# Altium schematic sheet 存储物柜V1.0.SchDoc
size A1
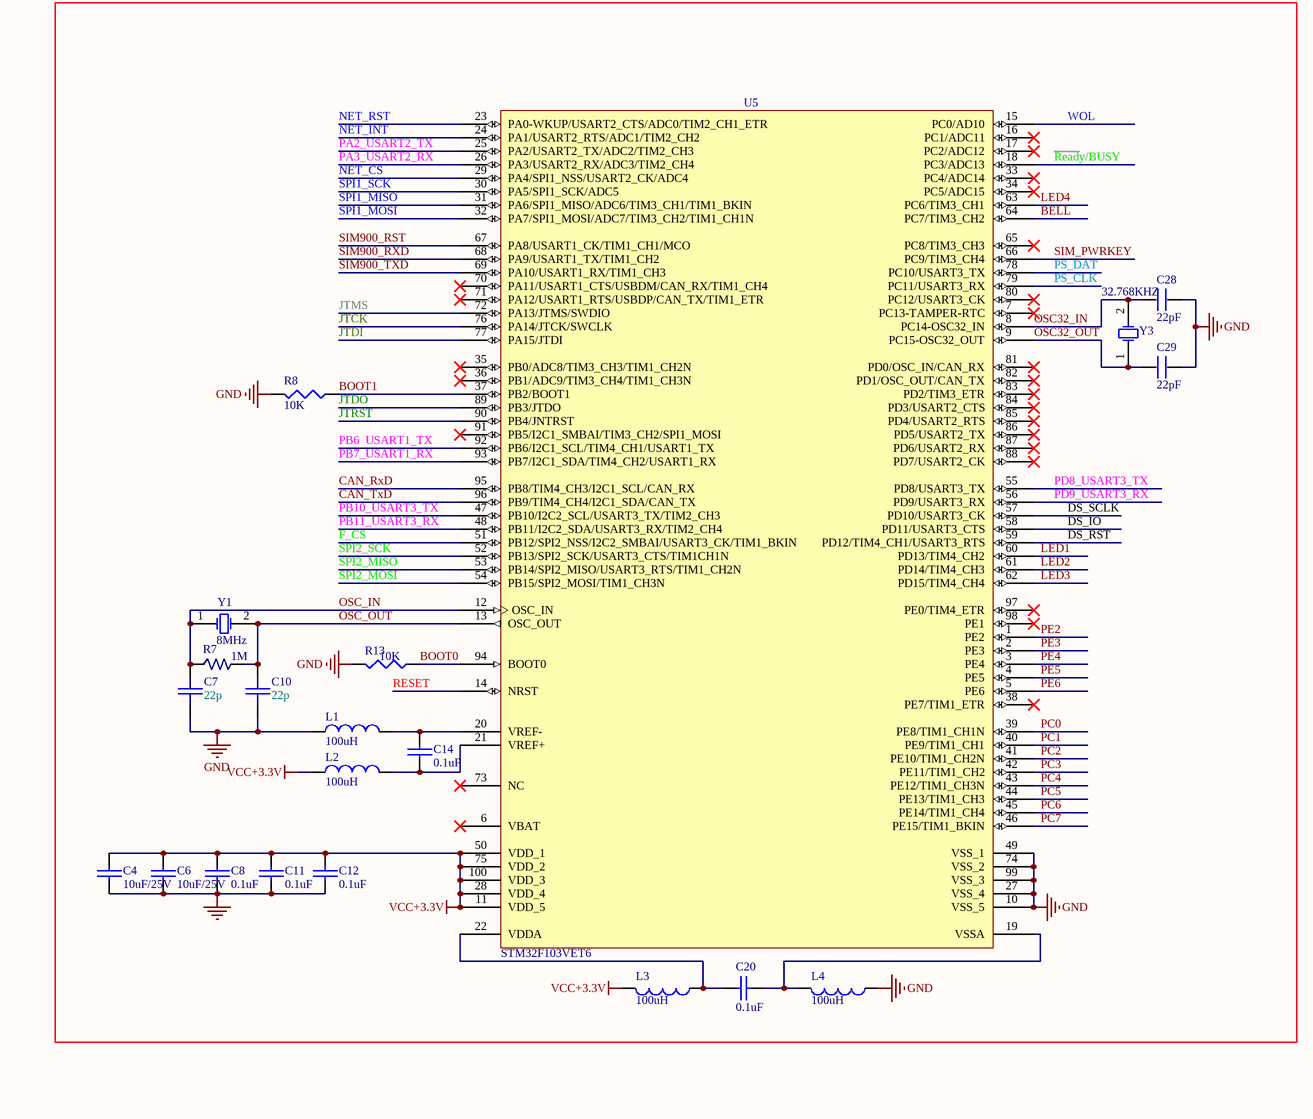
[diagram p0: 存储物柜V1.0.SchDoc, top left]
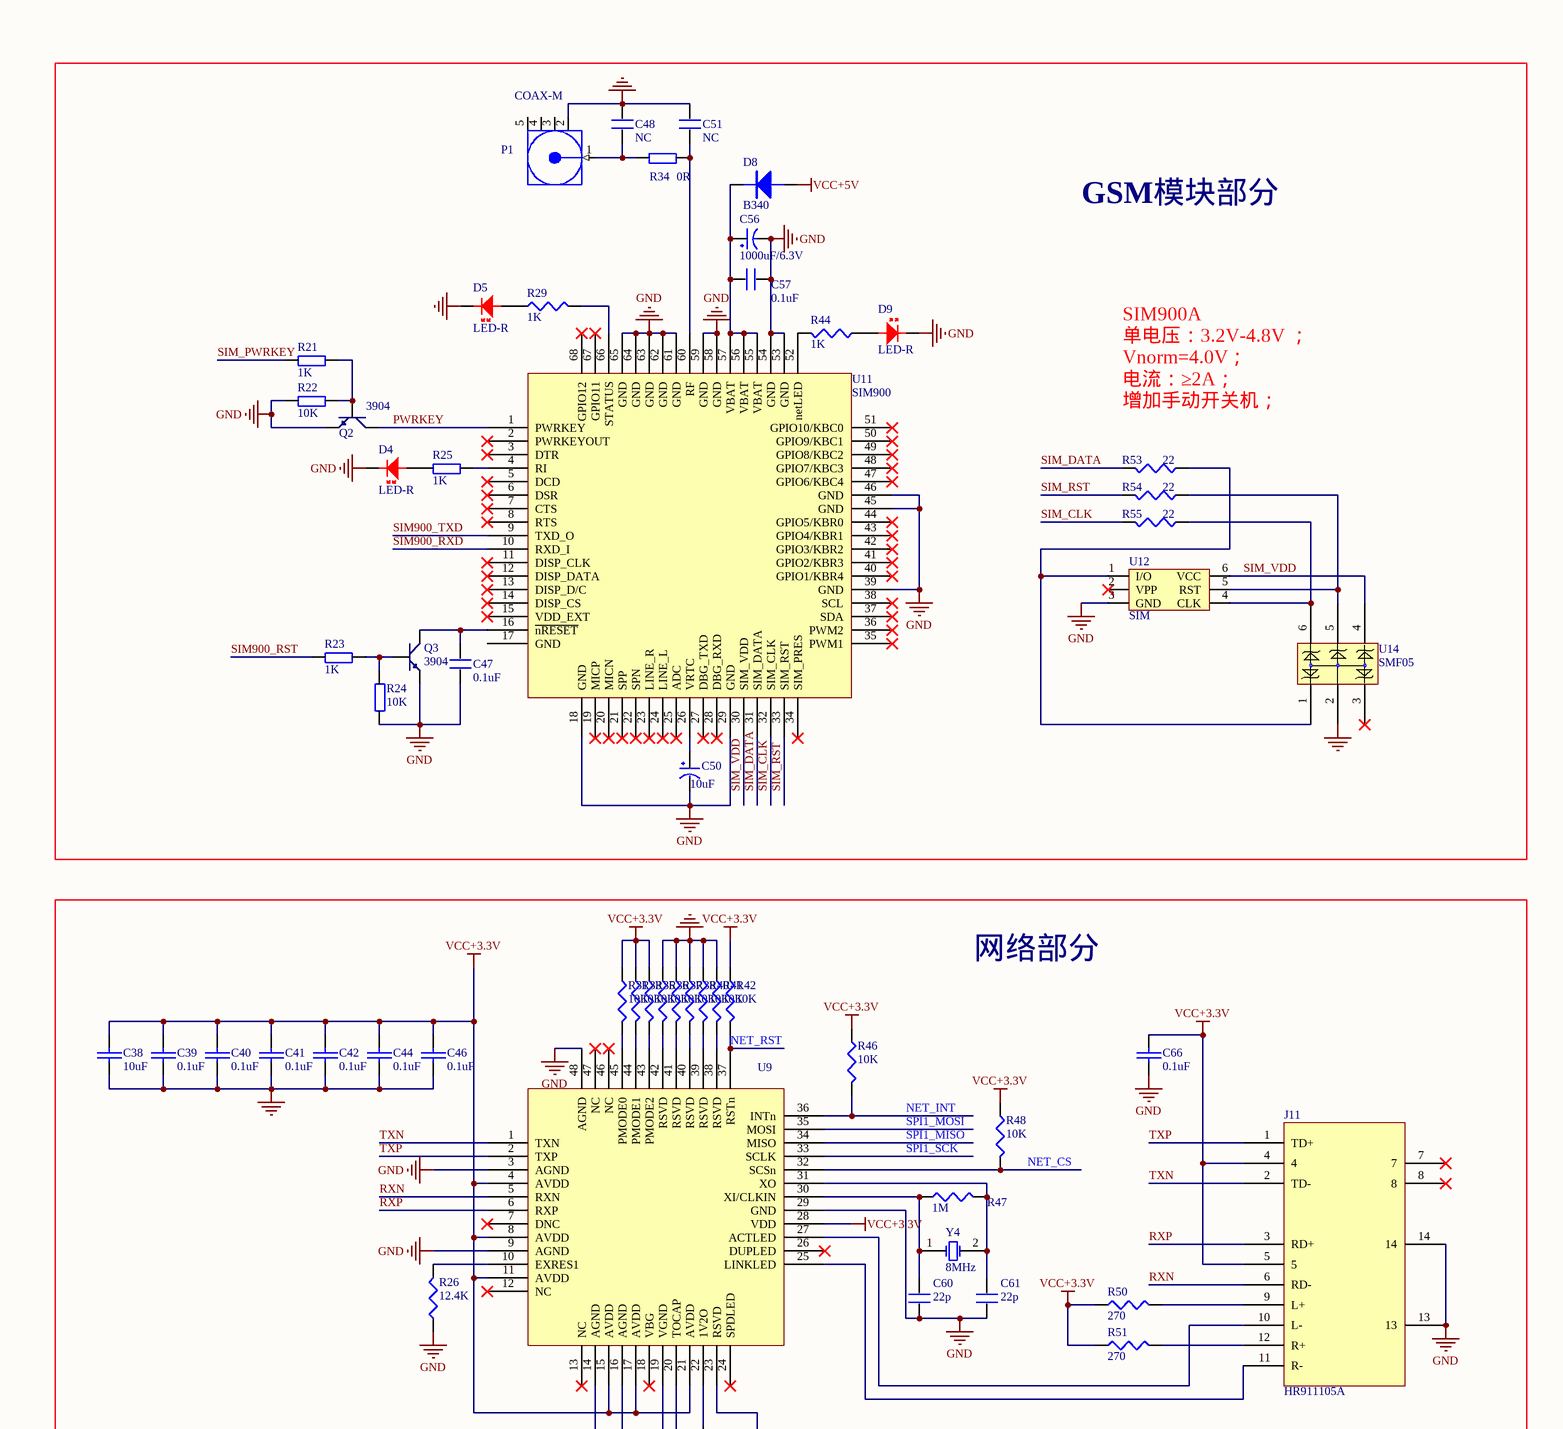
[diagram p1: 存储物柜V1.0.SchDoc, top right]
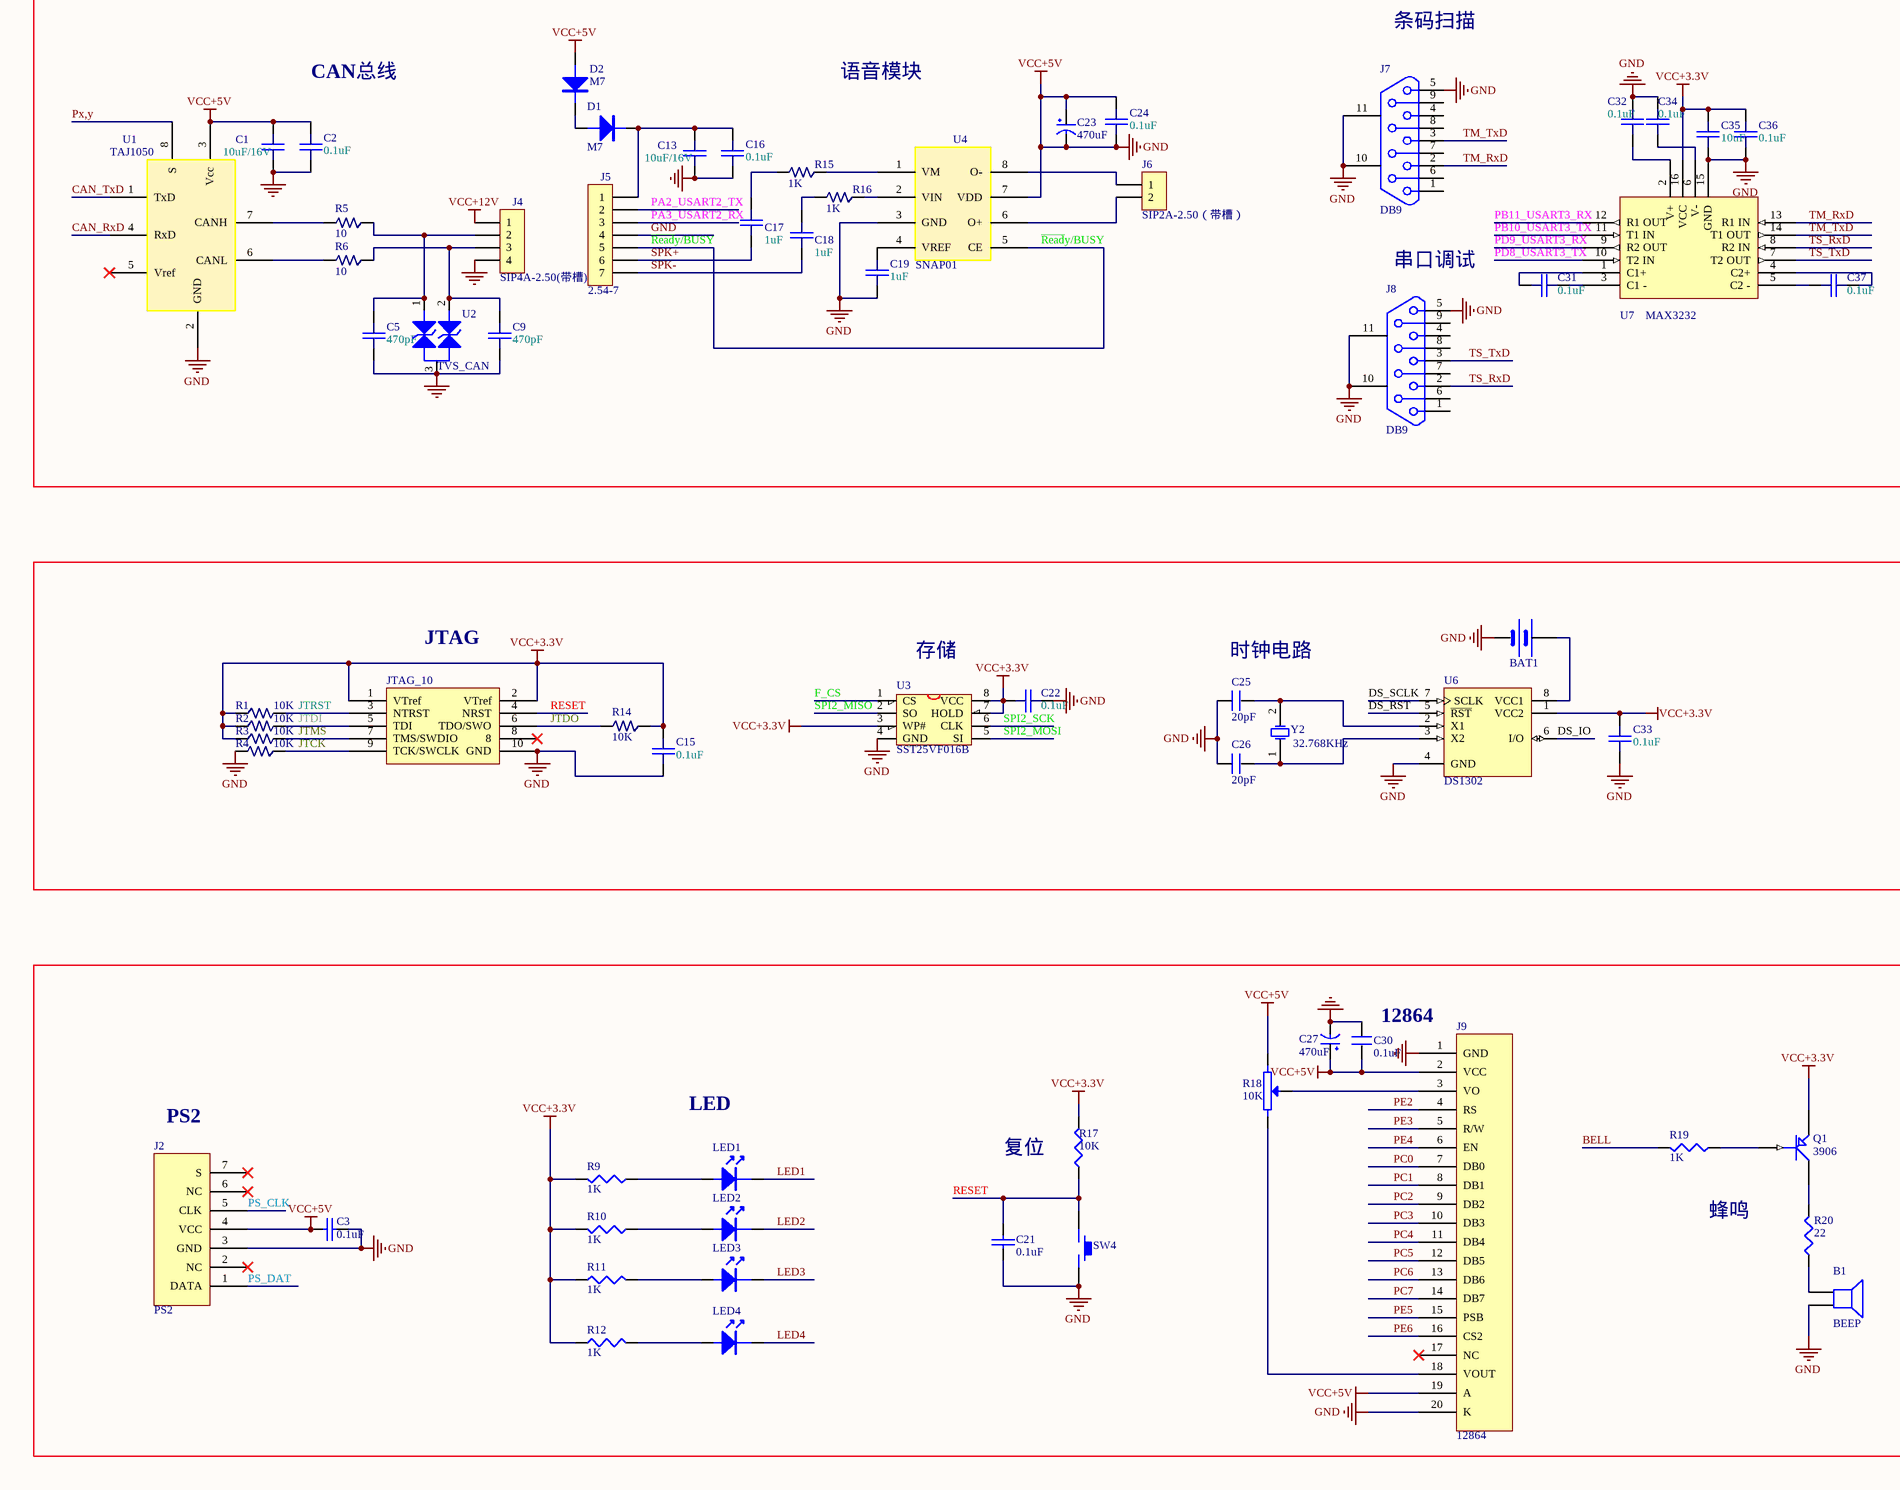
[diagram p2: 存储物柜V1.0.SchDoc, bottom left]
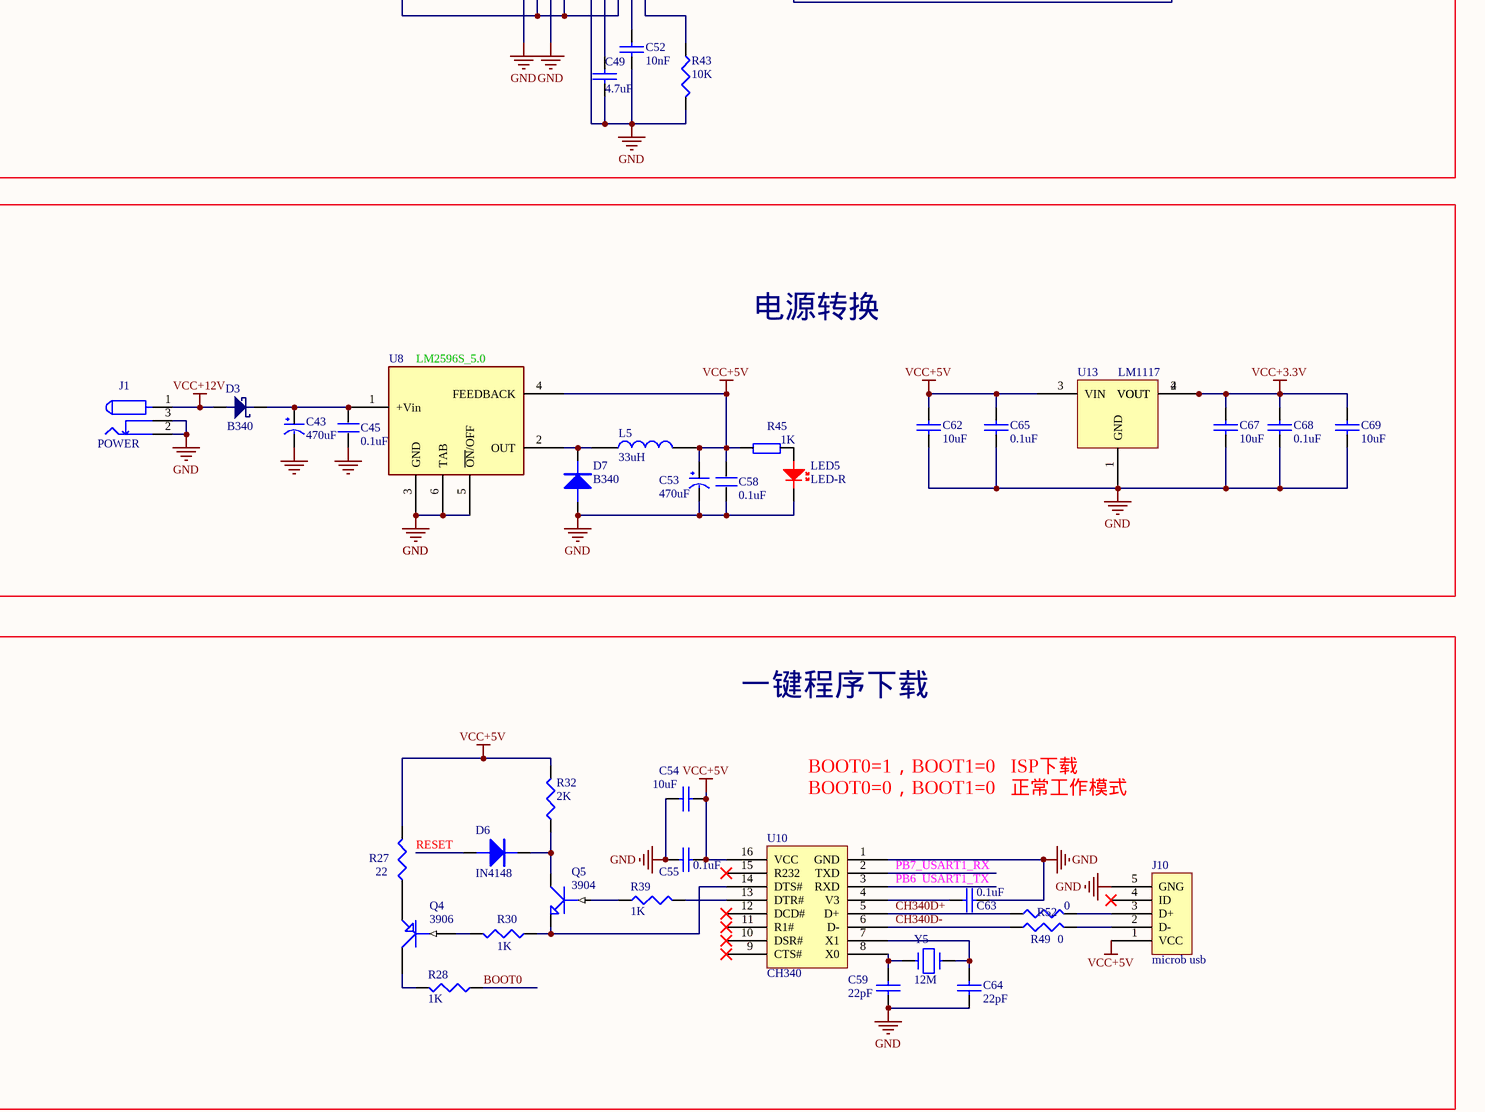
[diagram p3: 存储物柜V1.0.SchDoc, bottom right]

## Parts
B1  BEEP  [BEEP-12]
BAT1  BATT  [BATM]  (value not drawn)
C1  10uF/16V  [0805]
C2  0.1uF  [0603]
C3  0.1uF  [0603]
C4  10uF/25V  [0805]
C5  470pF  [0603]
C6  10uF/25V  [0805]
C7  22p  [0603]
C8  0.1uF  [0603]
C9  470pF  [0603]
C10  22p  [0603]
C11  0.1uF  [0603]
C12  0.1uF  [0603]
C13  10uF/16V  [0805]
C14  0.1uF  [0603]
C15  0.1uF  [0603]
C16  0.1uF  [0603]
C17  1uF  [0603]
C18  1uF  [0603]
C19  1uF  [0603]
C20  0.1uF  [0603]
C21  0.1uF  [0603]
C22  0.1uF  [0603]
C23  470uF  [RB5.0-8]
C24  0.1uF  [0603]
C25  20pF  [0603]
C26  20pF  [0603]
C27  470uF  [RB5.0-8]
C28  22pF  [0603]
C29  22pF  [0603]
C30  0.1uF  [0603]
C31  0.1uF  [0603]
C32  0.1uF  [0603]
C33  0.1uF  [0603]
C34  0.1uF  [0603]
C35  10uF  [0805]
C36  0.1uF  [0603]
C37  0.1uF  [0603]
C38  10uF  [0805]
C39  0.1uF  [0603]
C40  0.1uF  [0603]
C41  0.1uF  [0603]
C42  0.1uF  [0603]
C43  470uF  [RB5.0-8]
C44  0.1uF  [0603]
C45  0.1uF  [0603]
C46  0.1uF  [0603]
C47  0.1uF  [0603]
C48  NC  [0603]
C49  4.7uF  [0805]
C50  10uF  [0805]
C51  NC  [0603]
C52  10nF  [0603]
C53  470uF  [RB5.0-8]
C54  10uF  [0805]
C55  0.1uF  [0603]
C56  1000uF/6.3V  [7343]
C57  0.1uF  [0603]
C58  0.1uF  [0603]
C59  22pF  [0603]
C60  22p  [0603]
C61  22p  [0603]
C62  10uF  [0805]
C63  0.1uF  [0603]
C64  22pF  [0603]
C65  0.1uF  [0603]
C66  0.1uF  [0603]
C67  10uF  [0805]
C68  0.1uF  [0603]
C69  10uF  [0805]
D1  M7  [SMB]
D2  M7  [SMB]
D3  B340  [SMB]
D4  LED-R  [LED-0805]
D5  LED-R  [LED-0805]
D6  IN4148  [SOD-23]
D7  B340  [SMB]
D8  B340  [SMB]
D9  LED-R  [LED-0805]
J1  POWER  [DC10B]
J2  PS2  [PS2-6PIN]
J3  JTAG_10  [JTAG_10]
J4  SIP4A-2.50(带槽)  [5.08_4P]
J5  2.54-7  [SYN6288]
J6  SIP2A-2.50（带槽）  [2.54]
J7  DB9  [DB9/M]
J8  DB9  [DB9/M]
J9  12864  [XH2.54-20P]
J10  microb usb  [USB_micro]
J11  HR911105A  [HR911105A]
L1  100uH  [0805]
L2  100uH  [0805]
L3  100uH  [0805]
L4  100uH  [0805]
L5  33uH  [INDUCTOR-1212]
LED1  (no value)  [LED-0805]
LED2  (no value)  [LED-0805]
LED3  (no value)  [LED-0805]
LED4  (no value)  [LED-0805]
LED5  LED-R  [LED-0805]
P1  COAX-M  [ST-TH1]
Q1  3906  [SOT-23]
Q2  3904  [SOT-23R]
Q3  3904  [SOT-23R]
Q4  3906  [SOT-23]
Q5  3904  [SOT-23]
R1  10K  [0603]
R2  10K  [0603]
R3  10K  [0603]
R4  10K  [0603]
R5  10  [0603]
R6  10  [0603]
R7  1M  [0805]
R8  10K  [0805]
R9  1K  [0603]
R10  1K  [0603]
R11  1K  [0603]
R12  1K  [0603]
R13  10K  [0603]
R14  10K  [0603]
R15  1K  [0603]
R16  1K  [0603]
R17  10K  [0603]
R18  10K  [RM065-V1]
R19  1K  [0603]
R20  22  [0603]
R21  1K  [0603]
R22  10K  [0603]
R23  1K  [0603]
R24  10K  [0603]
R25  1K  [0603]
R26  12.4K  [0603]
R27  22  [0603]
R28  1K  [0603]
R29  1K  [0603]
R30  1K  [0603]
R31  10K  [0603]
R32  2K  [0603]
R33  10K  [0603]
R34  0R  [0603]
R35  10K  [0603]
R36  10K  [0603]
R37  10K  [0603]
R38  10K  [0603]
R39  1K  [0603]
R40  10K  [0603]
R41  10K  [0603]
R42  10K  [0603]
R43  10K  [0603]
R44  1K  [0603]
R45  1K  [0603]
R46  10K  [0603]
R47  1M  [0603]
R48  10K  [0603]
R49  0  [0603]
R50  270  [0603]
R51  270  [0603]
R52  0  [0603]
R53  22  [0603]
R54  22  [0603]
R55  22  [0603]
SW4  KEY_M  [KEY_M]  (value not drawn)
U1  TAJ1050  [SO-8]
U2  TVS_CAN  [SOT-23]
U3  SST25VF016B  [SOIC-8]
U4  SNAP01  [sop-8]
U5  STM32F103VET6  [LQFP100_N]
U6  DS1302  [SOP-8]
U7  MAX3232  [SOP-16]
U8  LM2596S_5.0  [TO-263-5]
U9  W5500  [LQFP48_N]  (value not drawn)
U10  CH340  [SOP16]
U11  SIM900  [SIM-900]
U12  SIM  [sim-6p]
U13  LM1117  [AMS1117]
U14  SMF05  [SC70-6L]
Y1  8MHz  [XTAL_US]
Y2  32.768KHz  [cs-308]
Y3  32.768KHZ  [CS-308]
Y4  8MHz  [XTAL_US]
Y5  12M  [XTAL_US]

## Blocks framed on the sheet
GSM模块部分: C47 C48 C50 C51 C56 C57 D4 D5 D8 D9 P1 Q2 Q3 R21-R25 R29 R34 R44 R53-R55 U11 U12 U14
网络部分: C38-C42 C44 C46 C49 C52 C60 C61 C66 J11 R26 R31 R33 R35-R38 R40-R43 R46-R48 R50 R51 U9 Y4
电源转换: C43 C45 C53 C58 C62 C65 C67-C69 D3 D7 J1 L5 LED5 R45 U8 U13
一键程序下载: C54 C55 C59 C63 C64 D6 J10 Q4 Q5 R27 R28 R30 R32 R39 R49 R52 U10 Y5

## Nets
GND: B1.2 BAT1.2(GND) C1.1 C1.2 C2.1 C2.2 C3.1 C3.2 C4.1 C5.2 C6.1 C7.2 C8.1 C9.2 C10.2 C11.1 C12.1 C13.1 C15.2 C16.1 C19.2 C21.2 C22.2 C23.1(VCC) C23.2(GND) C24.1 C24.2 C25.1 C26.1 C27.1(VCC) C27.2(GND) C28.1 C29.1 C30.1 C30.2 C32.2 C33.1 C34.2 C35.1 C36.1 C38.1 C39.2 C40.2 C41.2 C42.2 C43.2(GND) C44.2 C45.1 C46.2 C47.1 C48.2 C49.1 C50.2(GND) C51.2 C52.2 C53.1(VCC) C53.2(GND) C54.1 C54.2 C55.1 C55.2 C56.2(GND) C57.2 C58.1 C58.2 C59.1 C60.1 C61.1 C62.1 C62.2 C63.1 C64.2 C65.1 C65.2 C66.2 C67.2 C68.2 C69.2 D2.1(A) D4.2 D5.2 D7.1(A) D8.1(A) D9.2 J1.2 J1.3 J2.3(GND) J2.4(VCC) J3.10(GND) J4.4 J5.4 J7.5 J7.10 J7.11 J8.5 J8.10 J8.11 J9.1(GND) J9.2(VCC) J9.19(A) J9.20(K) J10.1(VCC) J10.5(GNG) J11.13 J11.14 L1.1 L4.1 L5.2 LED5.2 P1.2(GND) Q2.1(E) Q3.1(E) R4.2 R8.2 R13.2 R18.1 R22.1 R24.1 R26.1 R27.2 R32.2 R36.1 R37.1 R38.1 R40.1 R41.1 R43.2 R45.1 SW4.2 U1.2(GND) U1.3(Vcc) U2.3 U3.4(GND) U4.3(GND) U4.7(VDD) U5.10(VSS_5) U5.27(VSS_4) U5.49(VSS_1) U5.74(VSS_2) U5.99(VSS_3) U6.4(GND) U7.15(GND) U8.3(GND) U8.4(FEEDBACK) U8.5(~{ON}/OFF) U8.6(TAB) U9.3(AGND) U9.9(AGND) U9.14(AGND) U9.16(AGND) U9.19(VGND) U9.29(GND) U9.48(AGND) U10.1(GND) U10.16(VCC) U11.18(GND) U11.29(GND) U11.39(GND) U11.45(GND) U11.46(GND) U11.53(GND) U11.54(GND) U11.58(GND) U11.59(GND) U11.61(GND) U11.62(GND) U11.63(GND) U11.64(GND) U11.65(GND) U12.3(GND) U13.1(GND) U13.3(VIN) U14.2  [also labelled VCC+5V]
VCC+3.3V: C4.2 C6.2 C8.2 C11.2 C12.2 C15.1 C22.1 C33.2 C35.2 C36.2 C38.2 C39.1 C40.1 C41.1 C42.1 C44.1 C46.1 C66.1 C67.1 C68.1 C69.1 J3.1(VTref) J3.2(VTref) J11.4 J11.5 L2.1 L3.2 Q1.2(E) R1.1 R2.1 R3.1 R9.2 R10.2 R11.1 R12.1 R14.1 R17.2 R31.1 R33.1 R35.1 R42.1 R46.1 R48.1 R50.1 R51.1 U3.3(WP#) U3.7(HOLD) U3.8(VCC) U5.11(VDD_5) U5.28(VDD_4) U5.50(VDD_1) U5.75(VDD_2) U5.100(VDD_3) U6.1(VCC2) U7.16(VCC) U9.4(AVDD) U9.8(AVDD) U9.11(AVDD) U9.15(AVDD) U9.17(AVDD) U9.21(AVDD) U9.28(VDD) U13.2(VOUT) U13.4(VOUT)
VCC+12V: D3.1 J1.1 J4.1
BELL: R19.2 U5.64(PC7/TIM3_CH2)
BOOT0: R13.1 R28.1 U5.94(BOOT0)
BOOT1: R8.1 U5.37(PB2/BOOT1)
CAN_RxD: U1.4(RxD) U5.95(PB8/TIM4_CH3/I2C1_SCL/CAN_RX)
CAN_TxD: U1.1(TxD) U5.96(PB9/TIM4_CH4/I2C1_SDA/CAN_TX)
CH340D+: R52.1 U10.5(D+)
CH340D-: R49.1 U10.6(D-)
DS_IO: U5.58(PD11/USART3_CTS) U6.6(I/O)
DS_RST: U5.59(PD12/TIM4_CH1/USART3_RTS) U6.5(~{RST})
DS_SCLK: U5.57(PD10/USART3_CK) U6.7(SCLK)
F_CS: U3.1(CS) U5.51(PB12/SPI2_NSS/I2C2_SMBAI/USART3_CK/TIM1_BKIN)
JTCK: J3.9(TCK/SWCLK) R4.1 U5.76(PA14/JTCK/SWCLK)
JTDI: J3.5(TDI) R2.2 U5.77(PA15/JTDI)
JTDO: J3.6(TDO/SWO) R14.2 U5.89(PB3/JTDO)
JTMS: J3.7(TMS/SWDIO) R3.2 U5.72(PA13/JTMS/SWDIO)
JTRST: J3.3(NTRST) R1.2 U5.90(PB4/JNTRST)
LED1: LED1.2 U5.60(PD13/TIM4_CH2)
LED2: LED2.2 U5.61(PD14/TIM4_CH3)
LED3: LED3.2 U5.62(PD15/TIM4_CH4)
LED4: LED4.2 U5.63(PC6/TIM3_CH1)
NET_CS: R48.2 U5.29(PA4/SPI1_NSS/USART2_CK/ADC4) U9.32(SCSn)
NET_INT: R46.2 U5.24(PA1/USART2_RTS/ADC1/TIM2_CH2) U9.36(INTn)
NET_RST: R42.2 U5.23(PA0-WKUP/USART2_CTS/ADC0/TIM2_CH1_ETR) U9.37(RSTn)
OSC32_IN: C28.2 U5.8(PC14-OSC32_IN) Y3.2(OSC2)
OSC32_OUT: C29.2 U5.9(PC15-OSC32_OUT) Y3.1(OSC1)
OSC_IN: C7.1 R7.1 U5.12(OSC_IN) Y1.1(OSC1)
OSC_OUT: C10.1 R7.2 U5.13(OSC_OUT) Y1.2(OSC2)
PA2_USART2_TX: J5.2 U5.25(PA2/USART2_TX/ADC2/TIM2_CH3)
PA3_USART2_RX: J5.3 U5.26(PA3/USART2_RX/ADC3/TIM2_CH4)
PB6  USART1_TX: U5.92(PB6/I2C1_SCL/TIM4_CH1/USART1_TX) U10.3(RXD)
PB7_USART1_RX: U5.93(PB7/I2C1_SDA/TIM4_CH2/USART1_RX) U10.2(TXD)
PB10_USART3_TX: U5.47(PB10/I2C2_SCL/USART3_TX/TIM2_CH3) U7.11(T1_IN)
PB11_USART3_RX: U5.48(PB11/I2C2_SDA/USART3_RX/TIM2_CH4) U7.12(R1_OUT)
PC0: J9.7(DB0) U5.39(PE8/TIM1_CH1N)
PC1: J9.8(DB1) U5.40(PE9/TIM1_CH1)
PC2: J9.9(DB2) U5.41(PE10/TIM1_CH2N)
PC3: J9.10(DB3) U5.42(PE11/TIM1_CH2)
PC4: J9.11(DB4) U5.43(PE12/TIM1_CH3N)
PC5: J9.12(DB5) U5.44(PE13/TIM1_CH3)
PC6: J9.13(DB6) U5.45(PE14/TIM1_CH4)
PC7: J9.14(DB7) U5.46(PE15/TIM1_BKIN)
PD8_USART3_TX: U5.55(PD8/USART3_TX) U7.10(T2_IN)
PD9_USART3_RX: U5.56(PD9/USART3_RX) U7.9(R2_OUT)
PE2: J9.4(RS) U5.1(PE2)
PE3: J9.5(R/W) U5.2(PE3)
PE4: J9.6(EN) U5.3(PE4)
PE5: J9.15(PSB) U5.4(PE5)
PE6: J9.16(CS2) U5.5(PE6)
PS_CLK: J2.5(CLK) U5.79(PC11/USART3_RX)
PS_DAT: J2.1(DATA) U5.78(PC10/USART3_TX)
PWRKEY: Q2.3(C) U11.1(PWRKEY)
Px,y: U1.8(S)
~{Read}y/BUSY: J5.5 U4.5(CE) U5.18(PC3/ADC13)
RESET: C21.1 D6.1(A) J3.4(NRST) R17.1 SW4.1 U5.14(NRST)
RXN: J11.6(RD-) U9.5(RXN)
RXP: J11.3(RD+) U9.6(RXP)
SIM900_RST: R23.1 U5.67(PA8/USART1_CK/TIM1_CH1/MCO)
SIM900_RXD: U5.68(PA9/USART1_TX/TIM1_CH2) U11.10(RXD_I)
SIM900_TXD: U5.69(PA10/USART1_RX/TIM1_CH3) U11.9(TXD_O)
SIM_CLK: R55.2 U11.32(SIM_CLK)
SIM_DATA: R53.2 U11.31(SIM_DATA)
SIM_PWRKEY: R21.1 U5.66(PC9/TIM3_CH4)
SIM_RST: R54.2 U11.33(SIM_RST)
SIM_VDD: U11.30(SIM_VDD) U12.6(VCC) U14.4
SPI1_MISO: U5.31(PA6/SPI1_MISO/ADC6/TIM3_CH1/TIM1_BKIN) U9.34(MISO)
SPI1_MOSI: U5.32(PA7/SPI1_MOSI/ADC7/TIM3_CH2/TIM1_CH1N) U9.35(MOSI)
SPI1_SCK: U5.30(PA5/SPI1_SCK/ADC5) U9.33(SCLK)
SPI2_MISO: U3.2(SO) U5.53(PB14/SPI2_MISO/USART3_RTS/TIM1_CH2N)
SPI2_MOSI: U3.5(SI) U5.54(PB15/SPI2_MOSI/TIM1_CH3N)
SPI2_SCK: U3.6(CLK) U5.52(PB13/SPI2_SCK/USART3_CTS/TIM1CH1N)
SPK+: C17.1 J5.6
SPK-: C18.1 J5.7
TM_RxD: J7.2 U7.13(R1_IN)
TM_TxD: J7.3 U7.14(T1_OUT)
TS_RxD: J8.2 U7.8(R2_IN)
TS_TxD: J8.3 U7.7(T2_OUT)
TXN: J11.2(TD-) U9.1(TXN)
TXP: J11.1(TD+) U9.2(TXP)
WOL: U5.15(PC0/AD10)
NetB1_1: B1.1 R20.1
NetBAT1_1: BAT1.1(VCC) U6.8(VCC1)
NetC5_1: C5.1 J4.2 R5.1 U2.1
NetC9_1: C9.1 J4.3 R6.1 U2.2(K)
NetC13_2: C13.2 C16.2 D1.2(K) J5.1
NetC14_1: C14.1 L1.2 U5.20(VREF-)
NetC14_2: C14.2 L2.2 U5.21(VREF+)
NetC17_2: C17.2 R15.2
NetC18_2: C18.2 R16.2
NetC19_1: C19.1 U4.4(VREF)
NetC20_1: C20.1 L3.1 U5.22(VDDA)
NetC20_2: C20.2 L4.2 U5.19(VSSA)
NetC25_2: C25.2 U6.2(X1) Y2.2(OSC2)
NetC26_2: C26.2 U6.3(X2) Y2.1(OSC1)
NetC31_1: C31.1 U7.1(C1+)
NetC31_2: C31.2 U7.3(C1_-)
NetC32_1: C32.1 U7.2(V+)
NetC34_1: C34.1 U7.6(V-)
NetC37_1: C37.1 U7.5(C2_-)
NetC37_2: C37.2 U7.4(C2+)
NetC43_1: C43.1(VCC) C45.2 D3.2 U8.1(+Vin)
NetC47_2: C47.2 Q3.3(C) U11.16(~{nRESET})
NetC48_1: C48.1 P1.1(Signal) R34.1
NetC49_2: C49.2 U9.20(TOCAP)
NetC50_1: C50.1(VCC) U11.26(VRTC)
NetC51_1: C51.1 R34.2 U11.60(RF)
NetC52_1: C52.1 U9.22(1V2O)
NetC56_1: C56.1(VCC) C57.1 D8.2(K) U11.55(VBAT) U11.56(VBAT) U11.57(VBAT)
NetC59_2: C59.2 U10.8(X0) Y5.1
NetC60_2: C60.2 R47.1 U9.30(XI/CLKIN) Y4.1(OSC1)
NetC61_2: C61.2 R47.2 U9.31(XO) Y4.2(OSC2)
NetC63_2: C63.2 U10.4(V3)
NetC64_1: C64.1 U10.7(X1) Y5.2
NetD1_1: D1.1(A) D2.2(K)
NetD4_1: D4.1 R25.1
NetD5_1: D5.1 R29.1
NetD6_2: D6.2(K) Q5.3(C) R32.1
NetD7_2: D7.2(K) L5.1 U8.2(OUT)
NetD9_1: D9.1 R44.1
NetJ6_1: J6.1 U4.8(O-)
NetJ6_2: J6.2 U4.6(O+)
NetJ9_3: J9.3(VO) R18.2
NetJ9_18: J9.18(VOUT) R18.3
NetJ10_2: J10.2(D-) R49.2
NetJ10_3: J10.3(D+) R52.2
NetJ11_9: J11.9(L+) R50.2
NetJ11_10: J11.10(L-) U9.27(ACTLED)
NetJ11_11: J11.11(R-) U9.25(LINKLED)
NetJ11_12: J11.12(R+) R51.2
NetLED1_1: LED1.1 R9.1
NetLED2_1: LED2.1 R10.1
NetLED3_1: LED3.1 R11.2
NetLED4_1: LED4.1 R12.2
NetLED5_1: LED5.1 R45.2
NetQ1_1: Q1.1(B) R19.1
NetQ1_3: Q1.3(C) R20.2
NetQ2_2: Q2.2(B) R21.2 R22.2
NetQ3_2: Q3.2(B) R23.2 R24.2
NetQ4_1: Q4.1(B) R30.2
NetQ4_2: Q4.2(E) R27.1
NetQ4_3: Q4.3(C) R28.2
NetQ5_1: Q5.1(B) R39.1
NetQ5_2: Q5.2(E) R30.1 U10.14(DTS#)
NetR5_2: R5.2 U1.7(CANH)
NetR6_2: R6.2 U1.6(CANL)
NetR15_1: R15.1 U4.1(VM)
NetR16_1: R16.1 U4.2(VIN)
NetR25_2: R25.2 U11.4(RI)
NetR26_2: R26.2 U9.10(EXRES1)
NetR29_2: R29.2 U11.66(STATUS)
NetR31_2: R31.2 U9.45(PMODE0)
NetR33_2: R33.2 U9.44(PMODE1)
NetR35_2: R35.2 U9.43(PMODE2)
NetR36_2: R36.2 U9.42(RSVD)
NetR37_2: R37.2 U9.41(RSVD)
NetR38_2: R38.2 U9.40(RSVD)
NetR39_2: R39.2 U10.13(DTR#)
NetR40_2: R40.2 U9.39(RSVD)
NetR41_2: R41.2 U9.38(RSVD)
NetR43_1: R43.1 U9.23(RSVD)
NetR44_2: R44.2 U11.52(netLED)
NetR53_1: R53.1 U12.1(I/O) U14.1
NetR54_1: R54.1 U12.5(RST) U14.5
NetR55_1: R55.1 U12.4(CLK) U14.6

Not connected (* = marked no-connect by the designer): J2 2(NC)* 6(NC)* 7(S)*; J3 8*; J7 1 4 6 7 8 9; J8 1 4 6 7 8 9; J9 17(NC)*; J10 4(ID)*; J11 7* 8*; P1 3(GND) 4(GND) 5(GND); U1 5(Vref)*; U5 6(VBAT)* 7(PC13-TAMPER-RTC)* 16(PC1/ADC11)* 17(PC2/ADC12)* 33(PC4/ADC14)* 34(PC5/ADC15)* 35(PB0/ADC8/TIM3_CH3/TIM1_CH2N)* 36(PB1/ADC9/TIM3_CH4/TIM1_CH3N)* 38(PE7/TIM1_ETR)* 65(PC8/TIM3_CH3)* 70(PA11/USART1_CTS/USBDM/CAN_RX/TIM1_CH4)* 71(PA12/USART1_RTS/USBDP/CAN_TX/TIM1_ETR)* 73(NC)* 80(PC12/USART3_CK)* 81(PD0/OSC_IN/CAN_RX)* 82(PD1/OSC_OUT/CAN_TX)* 83(PD2/TIM3_ETR)* 84(PD3/USART2_CTS)* 85(PD4/USART2_RTS)* 86(PD5/USART2_TX)* 87(PD6/USART2_RX)* 88(PD7/USART2_CK)* 91(PB5/I2C1_SMBAI/TIM3_CH2/SPI1_MOSI)* 97(PE0/TIM4_ETR)* 98(PE1)*; U9 7(DNC)* 12(NC)* 13(NC)* 18(VBG)* 24(SPDLED)* 26(DUPLED)* 46(NC)* 47(NC)*; U10 9(CTS#)* 10(DSR#)* 11(R1#)* 12(DCD#)* 15(R232)*; U11 2(PWRKEYOUT)* 3(DTR)* 5(DCD)* 6(DSR)* 7(CTS)* 8(RTS)* 11(DISP_CLK)* 12(DISP_DATA)* 13(DISP_D/C)* 14(DISP_CS)* 15(VDD_EXT)* 17(GND) 19(MICP)* 20(MICN)* 21(SPP)* 22(SPN)* 23(LINE_R)* 24(LINE_L)* 25(ADC)* 27(DBG_TXD)* 28(DBG_RXD)* 34(SIM_PRES)* 35(PWM1)* 36(PWM2)* 37(SDA)* 38(SCL)* 40(GPIO1/KBR4)* 41(GPIO2/KBR3)* 42(GPIO3/KBR2)* 43(GPIO4/KBR1)* 44(GPIO5/KBR0)* 47(GPIO6/KBC4)* 48(GPIO7/KBC3)* 49(GPIO8/KBC2)* 50(GPIO9/KBC1)* 51(GPIO10/KBC0)* 67(GPIO11)* 68(GPIO12)*; U12 2(VPP)*; U14 3*

## Notes on the sheet
- (near R53) SIM900A
  单电压：3.2V-4.8V ；
  Vnorm=4.0V；
  电流：≥2A；
  增加手动开关机；
- 条码扫描
- CAN总线
- 语音模块
- 串口调试
- JTAG
- (near U3) 存储
- (near C25) 时钟电路
- BOOT0=1，BOOT1=0   ISP下载
  BOOT0=0，BOOT1=0   正常工作模式
- (near C30) 12864
- (near J2) PS2
- LED
- 复位
- 蜂鸣

## Library data of the parts
B1 = SPEAKER
BAT1 = BAT
C1 C2 C5 C7 C9 C10 C13 C15-C19 C22 C24 C31-C37 = CAP: 陶瓷电容
C3 C4 C6 C8 C11 C12 C14 C20 C21 C23 C27 C39-C44 C46 C50 C52 C53 C55 C56 C62 C63 C65-C69 = CAP
C25 C26 C28-C30 C45 C47 C48 C51 C57 C58 C60 C61 = C
C38 C49 C54 C59 C64 = CAP: 0.1uF
D1 D2 D6-D8 = DIODE
D3 = 1N5824(SS54): 肖特基二极管
D4 D5 D9 LED5 = LED-RED: 红色LED
J1 = POW
L1-L5 = INDUCTOR
LED1-LED4 = LED
P1 = COAX-M: SMA-J-P-H-ST-TH1; PackageDocument: Rev. A, 16-Jun-1997; PCB_Layout: Complies with manufacturer's recommendation.; DrillSize: Corresponds to nominal value.; Published: 15-Jul-2004; LatestRevisionDate: 15-Jul-2004; LatestRevisionNote: Component Replaced.; DatasheetDocument: 30-May-2003; PackageReference: 908-21103; Publisher: Altium Limited; ComponentLink1Description: Manufacturer Link; ComponentLink1URL: http://www.amphenolrf.com/
Q1 Q4 = PNP1
Q2 Q3 = NPN: 8050/BCW846/BCW847
Q5 = NPN1
R1-R7 R14-R16 = RES-1%: 高精度电阻
R8-R13 R17 R19 R20 R26-R33 R35-R44 R46-R55 = RES1
R18 = POT2
R21-R25 R34 R45 = Res
U3 = W25X16: W25X16;SST25VF016;MX25L1605
U5 = STM32F103VET6: STM32 ARM-based 32-bit MCU with 64 Kbytes Flash, 100-pin LQFP, Industrial Temperature; Published: 30-May-2008; DatasheetVersion: rev6, Mar-2008; PackageVersion: Mar-2008; PackageReference: LQFP100; Publisher: Altium Limited; PackageDescription: 100-Pin Low-Profile Quad Flat Pack, 14 x 14 mm Body, 0.5 mm Pitch (LQFP100); ComponentLink1Description: Manufacturer Link; ComponentLink1URL: www.st.com/stm32; ComponentLink2Description: Datasheet; ComponentLink2URL: http://www.st.com/stonline/products/literature/ds/13587.pdf
U6 = DS1302: 实时时钟
U7 = MAX232
U8 = LM2596S_5.0: 3A开关电源芯片
U9 = W5500: 以太网
U12 = SIM: 手机SIM卡
Y1-Y4 = XTAL: Crystal Oscillator; Published: 8-Jun-2000; LatestRevisionDate: 17-Jul-2002; LatestRevisionNote: Re-released for DXP Platform.; Publisher: Altium Limited
Y5 = CRYSTAL